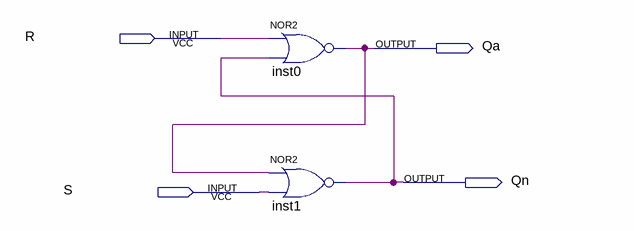
[diagram p0: schematic sheet]
// Quartus schematic lab9step1a.bdf as structural Verilog: 2 symbols, 4 pins
module lab9step1a (
  input  R,
  input  S,
  output Qa,
  output Qn
);

  nor inst0 (Qa, R, Qn);
  nor inst1 (Qn, Qa, S);
endmodule
